# Altium schematic sheet SATA_CON.SchDoc
size 420 x 297 mm; SheetNumber: 8; SheetTotal: 8; ModifiedBy: -; CheckedDate: -; Title2: Title 2; DivGrp: WUT ISE; Designer: G.Kasprowicz
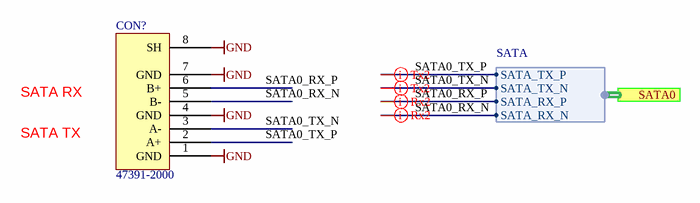
[diagram p0: SATA_CON.SchDoc]

## Parts
CON?  47391-2000  [47391-2000]

## Ports
SATA0 (harness SATA)

## Harnesses
SATA: SATA_TX_N, SATA_TX_P, SATA_RX_N, SATA_RX_P

## Nets
GND: CON?.1(GND) CON?.4(GND) CON?.7(GND) CON?.8(SH)
SATA0_RX_N: CON?.5(B-) ; port SATA0.SATA_RX_N
SATA0_RX_P: CON?.6(B+) ; port SATA0.SATA_RX_P
SATA0_TX_N: CON?.3(A-) ; port SATA0.SATA_TX_N
SATA0_TX_P: CON?.2(A+) ; port SATA0.SATA_TX_P

## Layout directives
differential pair: SATA0_RX_N, SATA0_RX_P, SATA0_TX_N, SATA0_TX_P

## Notes on the sheet
- SATA TX
- SATA RX
- Project/Equipment
- Document
- Designer
- Drawn by
- Check.by
- Copyright WUT ISE 2024.
  This documentation describes Open Hardware and is licensed under the CERN OHL v.2. You may redistribute and modify this documentation under the terms of the CERN OHL v.2. (http://ohwr.org/CERNOHL). This documentation is distributed WITHOUT ANY EXPRESS OR IMPLIED WARRANTY, INCLUDING OF MERCHANTABILITY, SATISFACTORY QUALITY AND FITNESS FOR A PARTICULAR PURPOSE. Please see the CERN OHL v.2 for applicable conditions.
- Contact
- File
- Last Mod.
- Print Date
- Sheet
- Size
- A3
- of
- Rev

## Library data of the parts
CON? = SATA 47391-2000: 1.27mm Pitch External Serial ATA Plug with Flanged Shell, Bottom Mount, Right Angle; Manufacturer: Molex; ComponentLink1Description: Manufacturer Link; ComponentLink1Link: http://www.molex.com/; ComponentLink2Description: Datasheet; ComponentLink2Link: http://www.molex.com/pdm_docs/sd/473912000_sd.pdf